# EAGLE board sd2snes1 (EAGLE 4.15), part 1 of 2
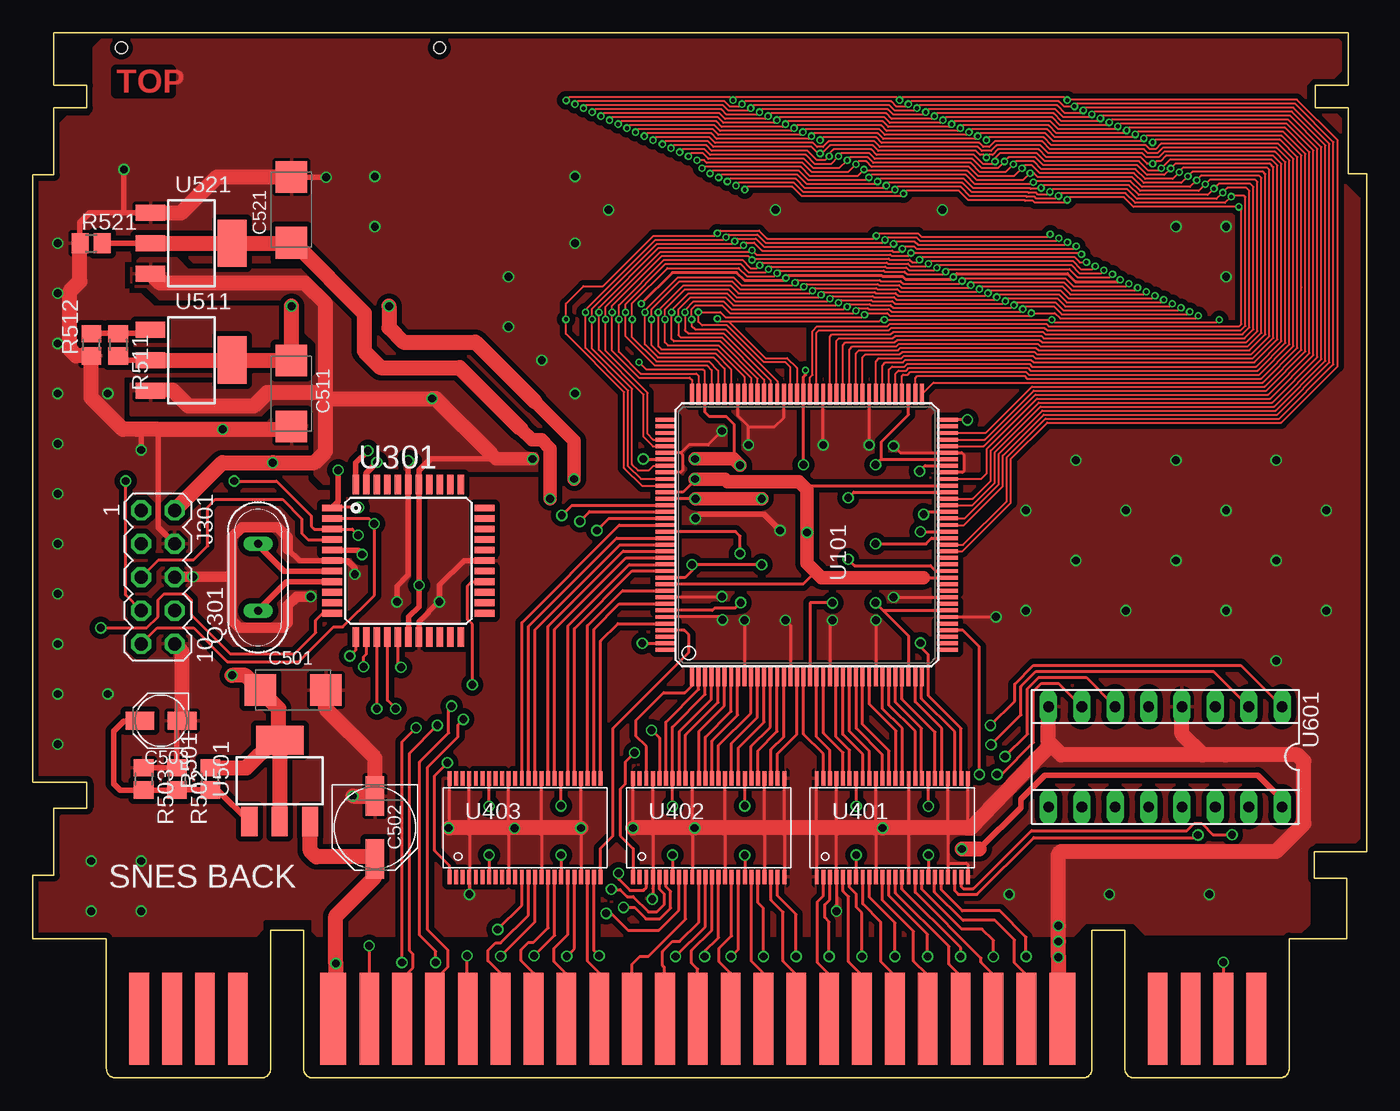
[diagram p4: board, top side]
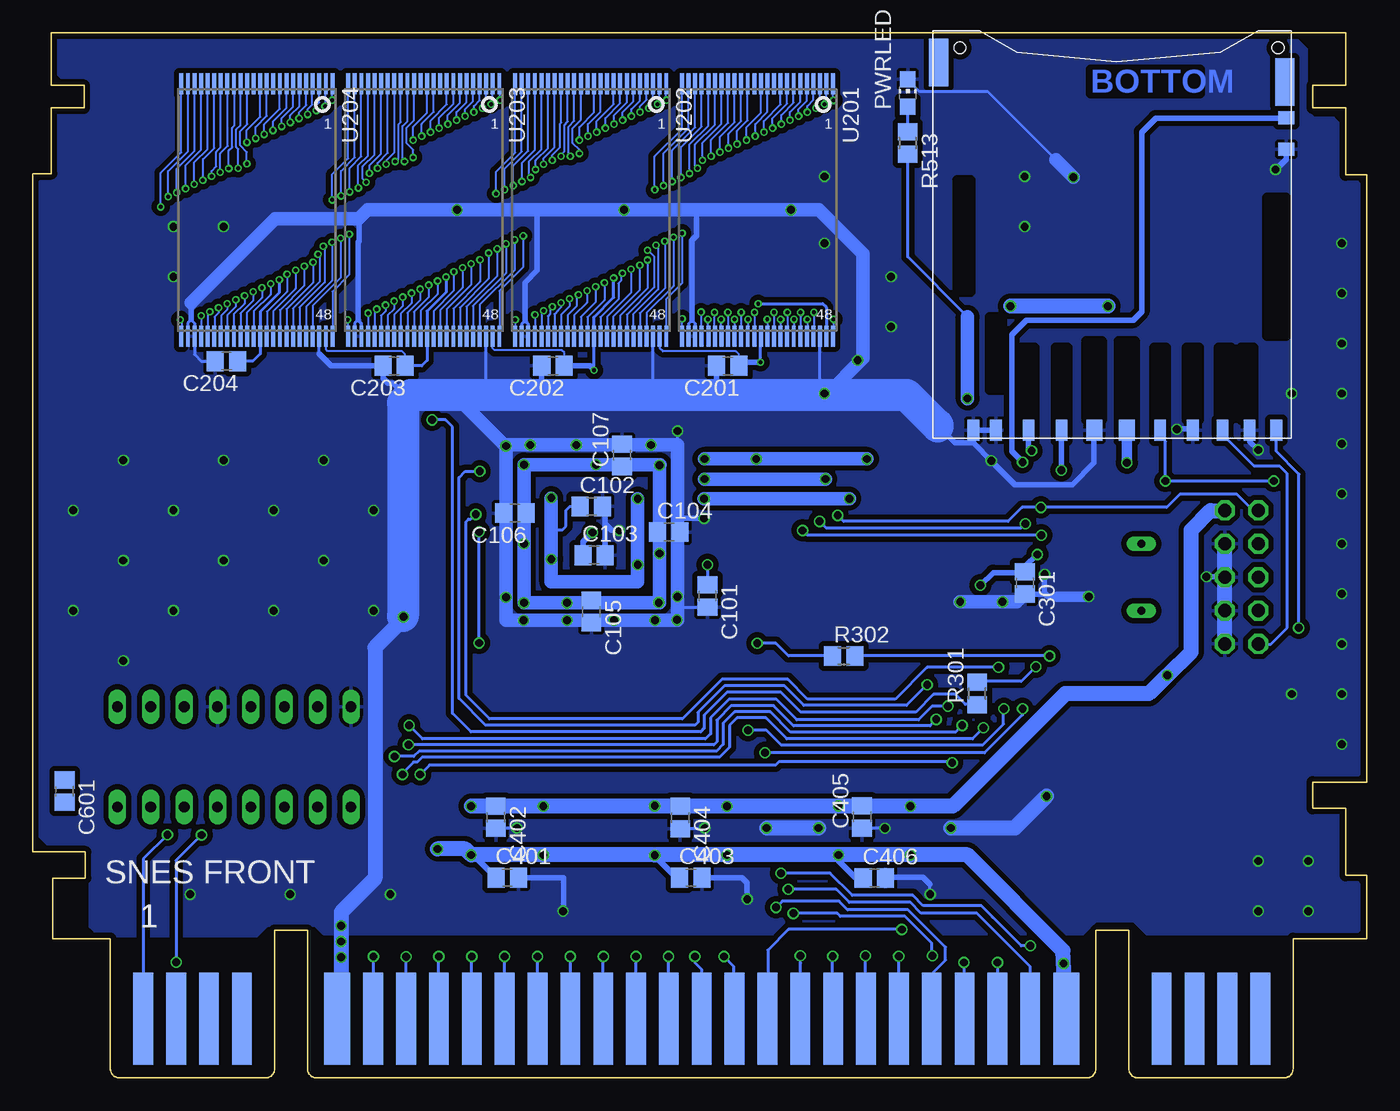
[diagram p5: board, bottom side, seen from below]

Size 101.5 x 79.5 mm. Coordinates in mm from the lower left corner, seen from the top.
Copper layers (1*16): Top 0.035mm / dielectric 1mm / Bottom 0.035mm
Design rules "myBilex DRU": minimum track width 6mil, minimum drill 0.3mm, track to track 6mil, track to pad 6mil, pad to pad 6mil, via to via 6mil, smd to smd 6mil, copper to edge 10mil, drill to drill 8mil, minimum pad ring 10mil, minimum via ring 5mil, stop-mask expansion 4mil, vias tented up to drill 0mil, thermal gap 10mil

## Footprints (pad centres in the part's own frame; a part is rotated, then mirrored left to right if it is on the bottom)
C0805 = smd 1.3 x 1.5: 1 -0.85,0; 2 0.85,0
SMC_C = smd 2.4 x 2.4: + -2.5,0; - 2.5,0
PANASONIC_D = smd 3 x 1.4: + 2.4,0; - -2.4,0
PANASONIC_B = smd 2.2 x 1.4: + 1.6,0; - -1.6,0
SNESCART = smd 1.5 x 7: 1 -42.5,-0.5; 2 -40,-0.5; 3 -37.5,-0.5; 4 -35,-0.5; 6 -25,-0.5; 7 -22.5,-0.5; 8 -20,-0.5; 9 -17.5,-0.5; 10 -15,-0.5; 11 -12.5,-0.5; 12 -10,-0.5; 13 -7.5,-0.5; 14 -5,-0.5; 15 -2.5,-0.5; 16 0,-0.5; 17 2.5,-0.5; 18 5,-0.5; 19 7.5,-0.5; 20 10,-0.5; 21 12.5,-0.5; 22 15,-0.5; 23 17.5,-0.5; 24 20,-0.5; 25 22.5,-0.5; 26 25,-0.5; 28 35,-0.5; 29 37.5,-0.5; 30 40,-0.5; 31 42.5,-0.5 | smd 2 x 7: 5 -27.75,-0.5; 27 27.75,-0.5 | smd 1.5 x 7 bottom: 32 -42.5,-0.5; 33 -40,-0.5; 34 -37.5,-0.5; 35 -35,-0.5; 37 -25,-0.5; 38 -22.5,-0.5; 39 -20,-0.5; 40 -17.5,-0.5; 41 -15,-0.5; 42 -12.5,-0.5; 43 -10,-0.5; 44 -7.5,-0.5; 45 -5,-0.5; 46 -2.5,-0.5; 47 0,-0.5; 48 2.5,-0.5; 49 5,-0.5; 50 7.5,-0.5; 51 10,-0.5; 52 12.5,-0.5; 53 15,-0.5; 54 17.5,-0.5; 55 20,-0.5; 56 22.5,-0.5; 57 25,-0.5; 59 35,-0.5; 60 37.5,-0.5; 61 40,-0.5; 62 42.5,-0.5 | smd 2 x 7 bottom: 36 -27.75,-0.5; 58 27.75,-0.5
MA05-2 = drill 1.016 octagon: 1 -5.08,-1.27; 2 -5.08,1.27; 3 -2.54,-1.27; 4 -2.54,1.27; 5 0,-1.27; 6 0,1.27; 7 2.54,-1.27; 8 2.54,1.27; 9 5.08,-1.27; 10 5.08,1.27
CHIP-LED0805 = smd 1.2 x 1.2: A 0,-1.05; C 0,1.05
QS = drill 0.61 long: 1 -2.54,0; 2 2.54,0
R0805 = smd 1.3 x 1.5: 1 -0.85,0; 2 0.85,0
TQ144 = smd 1.6 x 0.3: P1 -10.7,8.75; P2 -10.7,8.25; P3 -10.7,7.75; P4 -10.7,7.25; P5 -10.7,6.75; P6 -10.7,6.25; P7 -10.7,5.75; P8 -10.7,5.25; P9 -10.7,4.75; P10 -10.7,4.25; P11 -10.7,3.75; P12 -10.7,3.25; P13 -10.7,2.75; P14 -10.7,2.25; P15 -10.7,1.75; P16 -10.7,1.25; P17 -10.7,0.75; P18 -10.7,0.25; P19 -10.7,-0.25; P20 -10.7,-0.75; P21 -10.7,-1.25; P22 -10.7,-1.75; P23 -10.7,-2.25; P24 -10.7,-2.75; P25 -10.7,-3.25; P26 -10.7,-3.75; P27 -10.7,-4.25; P28 -10.7,-4.75; P29 -10.7,-5.25; P30 -10.7,-5.75; P31 -10.7,-6.25; P32 -10.7,-6.75; P33 -10.7,-7.25; P34 -10.7,-7.75; P35 -10.7,-8.25; P36 -10.7,-8.75; P73 10.7,-8.75; P74 10.7,-8.25; P75 10.7,-7.75; P76 10.7,-7.25; P77 10.7,-6.75; P78 10.7,-6.25; P79 10.7,-5.75; P80 10.7,-5.25; P81 10.7,-4.75; P82 10.7,-4.25; P83 10.7,-3.75; P84 10.7,-3.25; P85 10.7,-2.75; P86 10.7,-2.25; P87 10.7,-1.75; P88 10.7,-1.25; P89 10.7,-0.75; P90 10.7,-0.25; P91 10.7,0.25; P92 10.7,0.75; P93 10.7,1.25; P94 10.7,1.75; P95 10.7,2.25; P96 10.7,2.75; P97 10.7,3.25; P98 10.7,3.75; P99 10.7,4.25; P100 10.7,4.75; P101 10.7,5.25; P102 10.7,5.75; P103 10.7,6.25; P104 10.7,6.75; P105 10.7,7.25; P106 10.7,7.75; P107 10.7,8.25; P108 10.7,8.75 | smd 0.3 x 1.6: P37 -8.75,-10.7; P38 -8.25,-10.7; P39 -7.75,-10.7; P40 -7.25,-10.7; P41 -6.75,-10.7; P42 -6.25,-10.7; P43 -5.75,-10.7; P44 -5.25,-10.7; P45 -4.75,-10.7; P46 -4.25,-10.7; P47 -3.75,-10.7; P48 -3.25,-10.7; P49 -2.75,-10.7; P50 -2.25,-10.7; P51 -1.75,-10.7; P52 -1.25,-10.7; P53 -0.75,-10.7; P54 -0.25,-10.7; P55 0.25,-10.7; P56 0.75,-10.7; P57 1.25,-10.7; P58 1.75,-10.7; P59 2.25,-10.7; P60 2.75,-10.7; P61 3.25,-10.7; P62 3.75,-10.7; P63 4.25,-10.7; P64 4.75,-10.7; P65 5.25,-10.7; P66 5.75,-10.7; P67 6.25,-10.7; P68 6.75,-10.7; P69 7.25,-10.7; P70 7.75,-10.7; P71 8.25,-10.7; P72 8.75,-10.7; P109 8.75,10.7; P110 8.25,10.7; P111 7.75,10.7; P112 7.25,10.7; P113 6.75,10.7; P114 6.25,10.7; P115 5.75,10.7; P116 5.25,10.7; P117 4.75,10.7; P118 4.25,10.7; P119 3.75,10.7; P120 3.25,10.7; P121 2.75,10.7; P122 2.25,10.7; P123 1.75,10.7; P124 1.25,10.7; P125 0.75,10.7; P126 0.25,10.7; P127 -0.25,10.7; P128 -0.75,10.7; P129 -1.25,10.7; P130 -1.75,10.7; P131 -2.25,10.7; P132 -2.75,10.7; P133 -3.25,10.7; P134 -3.75,10.7; P135 -4.25,10.7; P136 -4.75,10.7; P137 -5.25,10.7; P138 -5.75,10.7; P139 -6.25,10.7; P140 -6.75,10.7; P141 -7.25,10.7; P142 -7.75,10.7; P143 -8.25,10.7; P144 -8.75,10.7
TSOP48 = smd 0.3 x 1.6: 1 -5.75,-9.6; 2 -5.25,-9.6; 3 -4.75,-9.6; 4 -4.25,-9.6; 5 -3.75,-9.6; 6 -3.25,-9.6; 7 -2.75,-9.6; 8 -2.25,-9.6; 9 -1.75,-9.6; 10 -1.25,-9.6; 11 -0.75,-9.6; 12 -0.25,-9.6; 13 0.25,-9.6; 14 0.75,-9.6; 15 1.25,-9.6; 16 1.75,-9.6; 17 2.25,-9.6; 18 2.75,-9.6; 19 3.25,-9.6; 20 3.75,-9.6; 21 4.25,-9.6; 22 4.75,-9.6; 23 5.25,-9.6; 24 5.75,-9.6; 25 5.75,9.6; 26 5.25,9.6; 27 4.75,9.6; 28 4.25,9.6; 29 3.75,9.6; 30 3.25,9.6; 31 2.75,9.6; 32 2.25,9.6; 33 1.75,9.6; 34 1.25,9.6; 35 0.75,9.6; 36 0.25,9.6; 37 -0.25,9.6; 38 -0.75,9.6; 39 -1.25,9.6; 40 -1.75,9.6; 41 -2.25,9.6; 42 -2.75,9.6; 43 -3.25,9.6; 44 -3.75,9.6; 45 -4.25,9.6; 46 -4.75,9.6; 47 -5.25,9.6; 48 -5.75,9.6
TQFP44 = smd 1.5 x 0.5: 1 -5.8,4; 2 -5.8,3.2; 3 -5.8,2.4; 4 -5.8,1.6; 5 -5.8,0.8; 6 -5.8,0; 7 -5.8,-0.8; 8 -5.8,-1.6; 9 -5.8,-2.4; 10 -5.8,-3.2; 11 -5.8,-4; 23 5.8,-4; 24 5.8,-3.2; 25 5.8,-2.4; 26 5.8,-1.6; 27 5.8,-0.8; 28 5.8,0; 29 5.8,0.8; 30 5.8,1.6; 31 5.8,2.4; 32 5.8,3.2; 33 5.8,4 | smd 0.5 x 1.5: 12 -4,-5.8; 13 -3.2,-5.8; 14 -2.4,-5.8; 15 -1.6,-5.8; 16 -0.8,-5.8; 17 0,-5.8; 18 0.8,-5.8; 19 1.6,-5.8; 20 2.4,-5.8; 21 3.2,-5.8; 22 4,-5.8; 34 4,5.8; 35 3.2,5.8; 36 2.4,5.8; 37 1.6,5.8; 38 0.8,5.8; 39 0,5.8; 40 -0.8,5.8; 41 -1.6,5.8; 42 -2.4,5.8; 43 -3.2,5.8; 44 -4,5.8
TSSOP48 = smd 0.3 x 1.1: 1 -5.75,-3.75; 2 -5.25,-3.75; 3 -4.75,-3.75; 4 -4.25,-3.75; 5 -3.75,-3.75; 6 -3.25,-3.75; 7 -2.75,-3.75; 8 -2.25,-3.75; 9 -1.75,-3.75; 10 -1.25,-3.75; 11 -0.75,-3.75; 12 -0.25,-3.75; 13 0.25,-3.75; 14 0.75,-3.75; 15 1.25,-3.75; 16 1.75,-3.75; 17 2.25,-3.75; 18 2.75,-3.75; 19 3.25,-3.75; 20 3.75,-3.75; 21 4.25,-3.75; 22 4.75,-3.75; 23 5.25,-3.75; 24 5.75,-3.75; 25 5.75,3.75; 26 5.25,3.75; 27 4.75,3.75; 28 4.25,3.75; 29 3.75,3.75; 30 3.25,3.75; 31 2.75,3.75; 32 2.25,3.75; 33 1.75,3.75; 34 1.25,3.75; 35 0.75,3.75; 36 0.25,3.75; 37 -0.25,3.75; 38 -0.75,3.75; 39 -1.25,3.75; 40 -1.75,3.75; 41 -2.25,3.75; 42 -2.75,3.75; 43 -3.25,3.75; 44 -3.75,3.75; 45 -4.25,3.75; 46 -4.75,3.75; 47 -5.25,3.75; 48 -5.75,3.75
SOT223 = smd 1.219 x 2.235: 1 -2.311,-3.099; 2 0,-3.099; 3 2.311,-3.099 | smd 3.6 x 2.2: TAB 0,3.099
SOCKED-16 = drill 0.813 long: 1 -8.89,-3.81; 2 -6.35,-3.81; 3 -3.81,-3.81; 4 -1.27,-3.81; 5 1.27,-3.81; 6 3.81,-3.81; 7 6.35,-3.81; 8 8.89,-3.81; 9 8.89,3.81; 10 6.35,3.81; 11 3.81,3.81; 12 1.27,3.81; 13 -1.27,3.81; 14 -3.81,3.81; 15 -6.35,3.81; 16 -8.89,3.81
JAE-SG5S009V1A = smd 0.9 x 1.6: 1 6.875,14.44; 2 4.375,14.44; 5 -3.125,14.44; 6 -5.625,14.44; 7 -7.875,14.44; 8 -9.925,14.44; 9 9.375,14.44; CARD_DET1 -11.975,14.44; CARD_DET2 11.075,14.44 | smd 1.2 x 1.6: 3 1.875,14.44; 4 -0.6,14.44 | smd 1.45 x 3.6: GND -12.625,-12.06; GND@1 13.725,-13.56 | smd 1.25 x 1: WP_1 -12.725,-9.36; WP_2 -12.725,-6.96 | hole 0.9: -12.1,-14.66; 12.1,-14.66

## Placement (x,y rotation side)
C101  100n  [C0805]  50.16,36.67 270 bottom
C102  100n  [C0805]  59,43.48 0 bottom
C103  100n  [C0805]  58.8,39.77 0 bottom
C104  100n  [C0805]  53.11,41.52 0 bottom
C105  100n  [C0805]  59,35.48 270 bottom
C106  100n  [C0805]  64.82,42.97 180 bottom
C107  100n  [C0805]  56.66,47.36 90 bottom
C201  100n  [C0805]  48.61,54.17 180 bottom
C202  100n  [C0805]  61.92,54.17 180 bottom
C203  100n  [C0805]  74.01,54.17 180 bottom
C204  100n  [C0805]  86.76,54.53 180 bottom
C301  100n  [C0805]  26,37.66 270 bottom
C401  100n  [C0805]  65.4,15.23 0 bottom
C402  100n  [C0805]  66.26,19.83 270 bottom
C403  100n  [C0805]  51.43,15.23 0 bottom
C404  100n  [C0805]  52.24,19.8 270 bottom
C405  100n  [C0805]  38.4,19.86 90 bottom
C406  100n  [C0805]  37.46,15.21 0 bottom
C501  T_100u  [SMC_C]  19.81,29.51 0 top
C502  100u/16V  [PANASONIC_D]  26.03,19.04 270 top
C503  22u/16V  [PANASONIC_B]  9.75,27.17 180 top
C511  T_100u  [SMC_C]  19.68,52.06 270 top
C521  T_100u  [SMC_C]  19.68,66.03 90 top
C601  100n  [C0805]  99.08,21.81 270 bottom
J1  CARTSLOT  [SNESCART]  50.6,5 0 bottom
J301  [MA05-2]  9.52,38.09 270 top
PWRLED  [CHIP-LED0805]  34.92,74.92 0 bottom
Q301  13MHz  [QS]  17.14,38.09 90 top
R301  270  [R0805]  29.64,29.25 90 bottom
R302  270  [R0805]  39.8,32.1 0 bottom
R501  100  [R0805]  13.51,22.75 90 top
R502  180  [R0805]  10.97,22.75 270 top
R503  2k2  [R0805]  8.43,22.75 270 top
R511  100  [R0805]  6.5,55.77 270 top
R512  100  [R0805]  4.47,55.77 90 top
R513  82  [R0805]  34.92,71.11 270 bottom
R521  100  [R0805]  4.44,63.49 0 top
U101  XC3S200TQ144TQ144  [TQ144]  58.9,41.31 90 top
U201  CY62167DV30ZXI  [TSOP48]  46.35,66.03 180 bottom
U202  CY62167DV30ZXI  [TSOP48]  59.05,66.03 180 bottom
U203  CY62167DV30ZXI  [TSOP48]  71.75,66.03 180 bottom
U204  CY62167DV30ZXI  [TSOP48]  84.45,66.03 180 bottom
U301  ATMEGA644-20AU  [TQFP44]  28.58,39.35 0 top
U401  74ALVC164245DGG  [TSSOP48]  65.4,19.04 0 top
U402  74ALVC164245DGG  [TSSOP48]  51.43,19.04 0 top
U403  74ALVC164245DGG  [TSSOP48]  37.46,19.04 0 top
U501  LM1117MPX-ADJ  [SOT223]  18.79,22.6 0 top
U511  LM1117MPX-ADJ  [SOT223]  12.06,54.6 270 top
U521  LM1117MPX-ADJ  [SOT223]  12.06,63.49 270 top
U601  CIC  [SOCKED-16]  86.18,24.43 180 top
U$2  JAE-SG5S009V1A  [JAE-SG5S009V1A]  18.84,63.7 180 bottom

## Tracks (layer width: path | path; a pad name or v marks a point on that pad's centre or on a via)
+1.25V  (via drill 0.6)
  Top 0.229: U101.P121 v50.41,44.06 | U101.P133 49.62,38.06 50.16,38.6 v50.16,39.03 v55.47,39.03 | U101.P61 62.47,44.56 v62.05,44.14 | U101.P49 68.74,38.56 68.32,38.98 62.53,38.98 v62.05,39.46
  Top 0.406: R521.2 U521.2
  Top 1.016: 37.13,49.4 37.99,48.53 38.71,48.53 39.37,47.87 v39.37,44.06 | v50.41,44.06 v55.47,44.06
  Top 1.143: U521.2 9.09,63.49 9.11,63.47 9.14,63.49 U521.TAB 19.68,63.49 19.71,63.52 | 19.71,63.52 C521.+ | 19.71,63.52 19.88,63.52 25.22,58.18 25.22,55.29 26.46,54.04 32.48,54.04 37.13,49.4
  Bottom 0.229: 50.16,37.66 C101.1 v50.16,39.03 | 62.05,44.11 v62.05,44.14 | C102.1 60.63,43.48 60.93,43.17 60.93,41.98 61.21,41.7 62.05,41.7 62.07,41.7
  Bottom 1.016: v39.37,44.06 v50.41,44.06 | v55.47,44.06 v55.47,39.03 55.47,37.74 62.05,37.74 v62.05,39.46 62.05,41.7 62.05,44.11
+2.5V  (via drill 0.6)
  Top 0.229: v50.39,45.56 50.39,45.48 49.47,44.56 U101.P120 | U101.P134 58.62,37.56 59.57,38.51 | U101.P48 67.74,38.06 67.74,38.07 | U101.P62 58.98,45.06 58.8,44.87
  Top 0.406: 58.92,41.52 58.95,41.52 v58.92,41.5 | R511.2 6.82,54.6 9.34,54.6
  Top 1.016: 38.22,51.43 41.19,48.46 v41.19,45.56 | v50.39,45.56 52.68,45.56 52.88,45.36 58.31,45.36 58.8,44.87 58.92,44.75 58.92,41.52 58.92,39.16 59.57,38.51 60.02,38.07 67.74,38.07 67.76,38.07
  Top 1.143: U511.2 9.34,54.6 U511.TAB 19.68,54.6 | 19.68,54.6 v19.68,58.72 | v27.1,58.72 27.1,57.07 28.19,55.97 33.68,55.97 38.22,51.43 | 19.68,54.6 C511.+
  Bottom 0.406: C103.1 59.65,40.77 v58.92,41.5
  Bottom 1.016: v41.19,45.56 v50.39,45.56
  Bottom 1.143: v19.68,58.72 v27.1,58.72
+3V3  (via drill 0.3, 0.6)
  Top 0.152: U101.P106 51.15,53.74 51,53.89 46.68,53.89 v46.12,54.45 | v58.8,53.84 58.82,53.84
  Top 0.229: U101.P3 51.15,30.62 | U101.P3 | U101.P3 51.15,29.18 48.66,26.69 48.66,22.81 U402.42 48.68,20.75 v48.69,20.67 | U403.42 34.71,20.75 v34.72,20.67 | U403.31 v40.21,20.7 v40.2,20.69 | U402.31 v54.18,20.7 v54.17,20.69 | U401.31 v68.14,20.67 | U401.42 v62.66,20.67 | U101.P138 51.72,35.56 51.89,35.73 53.44,35.73 v53.87,36.16 | U101.P19 59.15,36.13 59.15,36.14 v60.85,36.14 | U101.P34 66.65,33.62 v64.13,36.14 64.7,35.56 U101.P43 | U101.P54 68.4,41.06 67.97,40.63 v64.13,40.63 | 64.59,47.06 64.54,47.06 v64.13,46.65 | 64.59,47.06 U101.P66 | v58.64,46.65 58.65,46.63 U101.P91 58.65,52.14 58.64,52.14 58.64,53.33 58.8,53.48 v58.8,53.84 | U101.P106 51.15,50.64 51.48,50.31 52.78,50.31 53.39,49.7 53.39,47.08 53.36,47.06 | U101.P115 46.45,47.06 v46.45,47.08 | U101.P126 53.48,41.56 53.82,41.22 v53.82,39.9 | U101.P75 66.65,50.46 64.59,48.4 64.59,47.06 | 64.59,47.06 | 57.27,60.83 57.09,60.65 54.17,60.65 53.56,61.26 48.66,61.26 v46.3,58.9 | v57.3,60.85 57.27,60.83 | 57.27,60.83 57.5,61.05 64.59,61.05 64.66,60.98 66.19,60.98 66.39,60.77 69.9,60.77 v70.05,60.93 70.3,61.18 78.74,61.18 79.35,60.57 82.6,60.57 v82.75,60.72
  Top 0.406: 35.66,47.08 35.66,47.11 30.27,47.11 29.38,46.22 U301.38 v29.38,37.49 v29.38,37.48 29.38,35.86 28.6,35.07 28.6,33.53 | 28.6,33.53 28.6,33.24 | 28.6,33.53 U301.17 | U301.5 24.74,40.15 v25.07,39.82 | 30.4,51.68 30.4,51.73 30.37,51.71 v30.37,51.68
  Top 1.016: 34.9,47.44 35.25,47.08 35.66,47.08 v38.02,47.08 | v50.39,47.08 53.34,47.08 53.36,47.06 | 53.36,47.06 53.69,46.73 | 53.36,47.06 v53.82,46.6
  Top 1.143: U501.TAB U501.2 | 13.5,23.59 13.41,23.59 | R501.2 13.5,23.59 | 13.5,23.59 16.25,23.59 18.36,25.7 U501.TAB | J301.2 14.42,46.8 v18.26,46.8 21.43,46.8 22.27,47.64 22.27,51.68 | 22.27,51.68 22.27,51.96 22.09,52.14 17.83,52.14 16.78,51.1 11.86,51.1 10.64,52.32 8.99,52.32 U511.3 | U521.3 9.67,60.47 20.7,60.47 22.27,58.9 22.27,51.68 | 22.27,51.68 v30.37,51.68 30.4,51.68 30.65,51.68 34.9,47.44 | v15.16,30.62 16.19,30.62 C501.+ 18.72,28.1 18.72,25.7 U501.TAB | U501.TAB
  Bottom 0.152: 46.12,56.48 46.1,56.46 U201.37 | U202.47 53.77,56.4 53.77,55.47 53.56,55.26 48,55.26 47.77,55.03 47.77,54.42 47.76,54.44 C201.1 | U203.47 66.5,55.5 66.37,55.36 61.26,55.36 61.06,55.16 61.06,54.17 | U204.47 79.2,55.42 79.07,55.29 73.4,55.29 73.17,55.06 73.17,54.2 73.16,54.18 C203.1
  Bottom 0.229: 40.2,20.67 v40.2,20.69 | 36.67,20.67 36.67,20.72 36.69,20.71 C405.2 | 54.17,20.67 v54.17,20.69 54.2,20.69 54.16,20.65 C404.1 | C402.1 66.28,20.67 v68.14,20.67 | 53.82,36.19 53.87,36.19 v53.87,36.16 | 64.13,36.24 64.08,36.24 v64.13,36.14 | v64.13,40.63 64.11,40.63 63.97,40.77 C106.1 | v64.13,46.65 64.03,46.63 | 58.62,46.65 58.62,46.63 v58.64,46.65 | 46.4,47.08 46.4,47.06 v46.45,47.08 | 53.82,43.1 53.84,43.1 53.84,42.87 | C104.1 53.84,41.63 53.84,42.87 | 53.82,42.87 53.84,42.87 | 46.12,56.48 v46.12,54.45 46.1,54.42 | v58.8,53.84 58.8,55.01 U202.37 58.8,57.88 57.3,59.38 v57.3,60.85 | v46.3,58.9 41.4,58.9 41.12,58.62 41.12,56.43 U201.47 | v70.05,60.93 70.05,59.78 71.5,58.33 U203.37 71.5,54.58 71.9,54.17 C203.1 | U204.37 84.2,58.29 82.75,59.73 v82.75,60.72 | 30.37,57.88 30.35,57.88 34.92,62.45 R513.2 | 47.79,54.42 47.82,54.42 | 47.79,54.42 C201.1 | 47.77,54.42 47.79,54.42 | 58.77,53.84 58.75,53.82 | U204.37 84.22,56.41 84.2,56.38 | C204.1 84.76,54.53 84.2,55.09 84.2,56.33 84.22,56.36 84.2,56.38 U204.37
  Bottom 0.406: v25.07,39.82 25.07,39.85 26.03,38.88 26.03,38.49 | 26.03,38.45 26.03,38.4 | 26.03,38.45 26.03,38.49 | 26.03,38.49 C301.1 | v29.38,37.48 28.42,38.45 26.03,38.45 | 46.1,54.42 47.77,54.42 | v58.8,53.84 58.77,53.84 59.1,54.17 61.06,54.17 C202.1
  Bottom 0.813: v18.26,46.8 18.23,46.8 18.23,49.22 U$2.4
  Bottom 1.016: v38.02,47.08 46.4,47.08 v50.39,47.08 | v53.82,46.6 53.82,43.1 53.82,42.87 v53.82,39.9 53.82,36.19 53.82,36.14 57.63,36.14 | 57.63,36.14 v60.85,36.14 v64.13,36.14 64.13,36.24 v64.13,40.63 v64.13,46.65 58.62,46.65 57.88,46.65 | 57.88,46.65 53.79,46.65 | C107.1 56.66,46.65 57.88,46.65 | C105.1 59,36.14 57.63,36.14 | v30.37,51.68 30.37,57.88 30.37,57.9
  Bottom 1.143: v68.14,20.67 v62.66,20.67 54.17,20.67 v48.69,20.67 40.2,20.67 36.67,20.67 v34.72,20.67 31.49,20.67 22.93,29.23 16.58,29.23 v15.16,30.62 13.36,32.4 13.36,41.67 11.88,43.15 10.77,43.15 | 10.77,43.15 10.69,43.15 | 10.77,43.15 J301.2
  pour Top (isolate 0.406): 27.73,46.19 27.73,47.57 28.04,47.87 29.05,47.87 29.69,47.24 29.69,46.73 30.17,46.25 38.91,46.25 39.06,46.4 39.06,47.57 38.53,48.1 37.71,48.1 32.33,53.48 26.31,53.48 24.43,55.36 24.43,57.75 20.75,61.43 11.83,61.43 10.97,62.3 8.12,62.3 7.49,61.66 7.49,60.52 7.77,60.24 8.63,60.24 9.6,59.28 19.93,59.28 20.62,58.59 20.62,56.84 21.59,55.87 21.59,53.56 21.18,53.15 18.69,53.15 17.95,53.89 17.14,53.89 16.02,52.77 7.44,52.77 7.44,50.46 7.72,50.18 17.14,50.18 18.11,51.15 20.9,51.15 21.46,50.59 21.46,45.89 22.09,45.26 26.79,45.26
+5V  (via drill 0.6)
  Top 0.229: U403.18 40.21,16.93 v40.2,16.96 | U403.7 34.71,16.9 v34.72,16.96 | U402.18 v54.18,16.93 v54.17,16.93 | U402.7 48.68,16.9 v48.69,16.96 | U401.7 62.65,16.9 v62.66,16.96 | U401.18 68.15,16.9 v68.14,16.96
  Top 0.406: 72.03,17.42 75.18,20.57 75.18,21.2 77.01,23.03 93.21,23.03 95.07,21.18 U601.16
  Top 1.143: J1.27 23.06,4.54 v23.06,8.7 23.06,12.31 26.01,15.26 26.01,15.97 | 26.01,16.67 26.01,16.81 21.56,16.81 21.1,17.26 U501.3 | 26.01,16.67 C502.+ | 26.01,15.97 26.01,16.67 | 26.01,15.97 26.03,15.97 26,15.94 | v70.71,17.42 72.03,17.42 | U501.3
  Top 1.2: J1.27 23.11,4.5
  Bottom 0.229: 54.17,16.99 54.17,16.96 v54.17,16.93 | v68.14,16.96 68.14,16.99 | 40.23,16.96 40.2,16.93
  Bottom 0.406: 40.2,16.93 40.2,16.53 38.91,15.23 38.3,15.23 38.31,15.22 C406.1 | v68.14,16.96 68.14,16.83 67.85,16.83 C401.1 | v54.17,16.93 54.17,16.88 52.52,15.23 C403.1 | J1.27 23.06,4.54 v23.06,8.7
  Bottom 1.143: J1.27 23.1,9.69 30.37,16.96 v34.72,16.96 v40.2,16.96 40.23,16.96 v48.69,16.96 54.17,16.96 v62.66,16.96 v68.14,16.96 68.6,17.42 v70.71,17.42
BANK0_CE  (via drill 0.3)
  Top 0.152: U101.P77 65.65,53.58 65.88,53.82 66.47,53.82 66.67,54.02 75.71,54.02 75.92,53.82 93.21,53.82 95.32,55.92 95.32,69.66 94.53,70.45 86.1,70.45 85.7,70.05 84.73,70.05 84.43,70.35 77.26,70.35 76.68,70.93 73.33,70.93 72.92,70.53 72.21,70.53 71.9,70.83 64.46,70.83 64.05,71.24 60.55,71.24 60.14,70.83 59.69,70.83 59.38,71.14 51.91,71.14 51.51,71.54 47.39,71.54 v47.19,71.34
  Bottom 0.152: U201.12 46.1,73.42 47.19,72.33 v47.19,71.34
BANK1_CE  (via drill 0.3)
  Top 0.152: U101.P76 66.15,53.42 66.24,53.51 66.59,53.51 66.8,53.71 75.59,53.71 75.79,53.51 93.34,53.51 95.63,55.8 95.63,69.79 94.66,70.76 85.97,70.76 85.57,70.35 84.86,70.35 84.55,70.66 77.39,70.66 76.81,71.24 73.2,71.24 72.79,70.83 72.33,70.83 72.03,71.14 64.59,71.14 64.18,71.54 60.12,71.54 v59.91,71.34
  Bottom 0.152: U202.12 58.8,73.45 59.91,72.33 v59.91,71.34
BANK2_CE  (via drill 0.3)
  Top 0.152: U101.P74 67.15,53.22 67.33,53.41 75.46,53.41 75.66,53.21 93.47,53.21 95.93,55.67 95.93,69.92 94.79,71.06 85.85,71.06 85.44,70.66 84.98,70.66 84.68,70.96 77.52,70.96 76.93,71.54 72.77,71.54 v72.56,71.34
  Bottom 0.152: U203.12 71.5,73.42 72.56,72.36 v72.56,71.34
BANK3_CE  (via drill 0.3)
  Top 0.152: U101.P73 68.53,52.9 93.59,52.9 96.24,55.54 96.24,70.05 94.92,71.37 85.42,71.37 v85.21,71.16
  Bottom 0.152: U204.12 84.2,73.12 85.21,72.1 v85.21,71.16
CCLK  (via drill 0.6)
  Top 0.229: U101.P72 69.64,50.06 v71.12,50.06
  Bottom 0.229: v71.12,50.06 70.1,50.06 69.57,49.52 69.57,27.73 68.17,26.33 50.67,26.33 50.41,26.59 50.41,27.6 48.66,29.35 44.57,29.35 43.05,27.83 34.31,27.83 32.96,29.18 31.31,29.18 30.55,28.42 29.63,28.42 | 29.63,28.42 29.59,28.42 | R301.1 29.63,28.42
CCLK_AVR  (via drill 0.6)
  Top 0.229: U301.13 25.4,33.53 25.4,32.25 25.17,32.02 v25.17,31.29
  Bottom 0.229: 29.7,30.17 29.76,30.17 | 29.7,30.17 R301.2 | v25.17,31.29 26.28,30.17 29.7,30.17
DIN/FPGA_SS  (via drill 0.6)
  Top 0.229: U301.26 34.37,37.74 33.37,37.74 33.07,37.43 33.07,34.89 33.45,34.51 v33.45,29.91 | U101.P65 69.59,46.58 67.89,46.58 67.46,46.14 v67.48,46.14
  Bottom 0.229: v33.45,29.91 35.02,28.34 42.82,28.34 44.32,29.84 48.87,29.84 50.9,27.81 50.9,27.04 51.1,26.84 67.05,26.84 69.08,28.87 69.08,45.66 68.6,46.14 v67.48,46.14 67.46,46.14
GND  (via drill 0.6)
  Top 0.229: 38.71,19.02 38.71,18.99 | U403.34 38.71,19 38.71,18.99 | 36.22,19.04 36.22,19.02 36.22,18.99 36.6,18.99 | 36.22,19.04 36.22,19.07 36.21,19.07 U403.39 | 33.21,19.07 33.21,19.03 33.22,19.02 | 33.21,19.07 U403.45 | U403.48 31.71,19.03 31.69,19.02 | U403.4 | 36.22,19.04 36.27,18.99 36.6,18.99 | U403.10 36.21,19.04 36.22,19.04 | U403.15 38.71,18.99 | 38.71,18.99 38.43,18.99 38.35,19.07 36.67,19.07 36.6,18.99 | 36.6,18.99 v36.65,18.99 | v41.7,19.02 41.7,19.09 | U403.21 41.71,19.09 41.7,19.09 | U403.28 41.71,19.1 41.7,19.09 | 33.21,19.07 33.22,19.07 | 50.34,19.02 50.34,19.04 v50.36,19.02 | U402.39 50.18,19.02 50.19,19.02 | U402.48 45.68,19.03 45.69,19.02 | U402.45 47.18,19 47.19,18.99 47.19,19.02 47.18,19.01 U402.4 | U402.34 52.68,19.1 52.6,19.02 52.32,19.02 52.24,18.94 50.41,18.94 50.36,18.99 | U402.28 55.68,19.03 55.67,19.02 55.67,18.99 55.68,18.98 U402.21 | U402.25 57.18,19.03 57.17,19.02 57.18,19.01 U402.24 | U401.48 59.65,19.03 59.66,19.02 | 61.16,19.02 61.16,19.07 61.15,19.08 U401.45 | U401.39 64.15,19.1 64.16,19.09 64.16,19.02 U401.10 | 66.65,19.07 66.65,19.04 66.67,19.02 | 66.65,19.07 U401.34 | U401.28 69.65,19.03 69.64,19.02 69.64,16.35 | U401.25 71.15,19.03 71.14,19.02 | v50.36,19.02 50.36,18.99 | U402.10 50.18,18.81 50.36,18.99 | U402.15 52.68,18.66 52.24,19.09 50.39,19.09 50.31,19.02 v50.36,19.02 | 47.19,15.46 47.18,15.45 U402.4 | U401.1 59.63,15.31 59.63,19.02 | U401.4 61.13,15.31 61.13,19.02 | 66.65,19.07 U401.15 | U401.21 69.64,16.35 | U401.24 71.14,16.22 71.01,16.35 69.64,16.35 | 64.64,19.02 64.64,19.04 v64.66,19.02 | 61.16,15.31 U401.4 | 61.16,15.31 61.15,15.31 U401.4 | 61.16,15.31 v61.16,12.69
  Top 0.229: U403.4 | 33.24,19.02 33.24,18.99 33.22,18.97 | U402.4 47.18,14.4 47.19,14.39 47.19,13.68 47.11,13.61 v47.14,13.61 | U403.4 | U101.P114 48.22,47.54 49.3,47.54 | 49.3,47.54 49.32,47.54 49.93,48.15 51.38,48.15 v52.45,49.22 | U101.P117 49.29,46.06 49.45,46.22 49.45,47.39 49.3,47.54 | U101.P139 48.19,35.06 48.18,35.07 52.24,35.07 v52.47,34.84 | U101.P136 52.44,36.56 v52.45,36.62 | U101.P16 57.65,34.44 v57.27,34.82 | U101.P22 60.65,34.56 v60.85,34.82 | U101.P29 64.15,34.81 v64.16,34.82 | U101.P9 v54.15,34.81 v54.15,34.82 | U101.P42 v73.29,35.06 v73.3,35.07 | U101.P45 v65.51,36.56 v65.5,36.57 | U101.P101 53.65,50.38 54.45,49.57 54.45,49.52 | v54.45,48.15 54.45,49.52 | U101.P94 57.15,50.23 56.43,49.52 54.45,49.52 | U101.P88 v60.14,48.15 | U101.P81 v63.65,48.15 | 69.57,47.56 66.01,47.56 66.01,47.57 | 69.57,47.56 U101.P67 70.68,47.57 70.84,47.41 70.84,46.17 70.73,46.06 U101.P64 | 69.57,47.56 69.57,47.57 66.01,47.57 | v65.5,48.07 66.01,47.57 | 33.22,19.02 33.22,19.04 | 33.22,19.02 v33.22,13.96 33.22,15.28 U403.4
  Top 0.406: 10.94,23.58 10.94,23.54 | 10.94,23.58 R502.1 10.95,23.61 8.41,23.61 | C503.- 10.94,26.76 10.94,23.58 | 8.41,23.61 8.4,23.61 | R503.1 8.41,23.61 | 3.53,63.54 3.58,63.49 R521.1 3.55,63.49 3.53,63.52 3.58,63.57 3.58,65.07 4.31,65.8 6.93,65.8 | 6.93,65.8 U521.1 | 28.57,45.13 28.58,45.14 U301.39 | 28.57,45.13 v28.57,46.96 | v56.87,41.65 55.65,42.87 50.72,42.87 v50.41,42.56 | J301.4 9.52,41.9 9.52,49.34 | 6.93,65.8 v6.93,69.11 | U301.6 22.77,39.34 22.35,39.34 | 22.35,39.34 20.29,39.34 19.4,40.23 | 28.57,45.13 28.57,38.27 27.71,37.41 v27.71,36.21 | U301.28 32.8,39.35 30.96,37.51 30.96,36.19 v30.93,36.21 | U301.18 29.38,34.71 30.88,36.21 v30.93,36.21 | v27.71,36.21 27.71,36.19 | v30.93,36.21 30.96,36.21 | C521.- 19.67,68.53 19.66,68.52 v22.32,68.52 | 7.92,49.34 7.92,49.32 8.25,48.99 v8.25,47.77 | 22.35,39.34 23.95,39.34 24.51,38.78 v24.51,38.32 | v27.71,36.21 27.73,36.24
  Top 0.813: 19.4,40.23 19.4,41.14 18.64,41.9 15.92,41.9 15.13,41.12 15.13,38.12 | 15.13,38.12 15.13,34.82 15.72,34.23 19.02,34.23 19.4,34.61 19.4,35.96 20.06,36.62 v21.15,36.62 | 10.77,38.12 v12.19,38.12 15.13,38.12
  Top 1.143: 31.72,19.02 33.22,19.02 33.24,19.02 36.22,19.02 38.71,19.02 v41.7,19.02 | 45.72,19.02 47.19,19.02 50.19,19.02 50.31,19.02 50.34,19.02 v50.36,19.02 52.6,19.02 55.67,19.02 57.17,19.02 59.63,19.02 59.66,19.02 61.13,19.02 61.16,19.02 64.16,19.02 64.64,19.02 v64.66,19.02 66.67,19.02 69.64,19.02 71.14,19.02 71.37,19.02 77.47,25.37 | 78.05,4.45 78.05,4.21 | 78.05,4.45 J1.36 | 78.05,4.45 v78.05,9.19 v78.05,10.38 v78.05,11.57 78.05,17.04 78.25,17.24 94.61,17.24 96.72,19.35 96.72,24.1 96.24,24.58 90.78,24.58 | 90.78,24.58 89.02,24.58 87.45,26.15 U601.4 | U601.8 77.29,25.54 77.47,25.37 | 77.47,25.37 78.25,24.58 90.78,24.58 | 77.47,25.37 77.49,25.39 | J301.10 10.79,32.99 11.35,32.43 C503.- | v24.35,21.43 26.02,21.43 C502.- 26.03,24.35 22.3,28.08 22.3,29.5 C501.- | 31.72,19.02 31.69,19.02 | 31.72,19.02 v31.64,19.02 | 45.72,19.02 45.69,19.02 | 45.72,19.02 v45.66,19.02 | 19.71,49.34 19.68,49.37 C511.- | 19.71,49.34 v14.45,49.34 9.52,49.34 7.92,49.34 6.85,49.34 4.44,51.76 4.44,54.9 R512.1 4.45,54.93 3.3,54.93 2.81,55.42 2.81,59.83 3.58,60.6 3.58,63.49 | 19.71,49.34 19.73,49.32 | U521.1 11.27,65.8 14.02,68.55 19.55,68.55 19.57,68.53 C521.-
  Bottom 0.152: 54.33,51.94 54.3,51.96
  Bottom 0.229: C405.1 36.66,19.01 v36.65,18.99 | C404.2 50.43,18.95 v50.36,19.02 | C402.2 64.7,18.98 v64.66,19.02 | 33.7,15.21 C406.2 | v33.22,13.96 33.22,14.72 | 52.42,48.15 52.45,48.15 v52.45,49.22 | 55.62,48.15 55.62,48.13 55.65,48.1 56.66,48.1 | 52.45,35.96 52.47,35.96 | 52.47,35.96 52.46,35.97 | 52.48,35.97 52.45,35.93 52.47,35.93 52.47,35.96 | 52.45,34.87 52.47,34.87 v52.47,34.84 | v60.85,34.82 60.85,34.79 60.88,34.82 | 73.33,35.15 73.3,35.15 v73.3,35.07 | 52.45,40.48 52.37,40.48 52.37,41.41 C104.2 | 60.17,48.15 v60.14,48.15 | v65.5,48.07 65.48,48.07 | 65.63,42.97 C106.2 65.67,46.06 65.63,46.09 65.63,46.07 65.5,46.07 65.38,46.07 | 52.45,35.83 52.47,35.83 52.46,35.82 C101.2 | C102.2 58.11,43.48 58.09,43.5 57.95,43.36 | J301.10 J301.8 | J301.4 10.77,40.63 | J301.6 10.77,38.12 10.77,37.99 | 51.13,51.94 51.13,51.86 51.1,51.88 | 51.66,51.94 51.66,52.19 51.6,52.25 | U$2.6 13.24,49.28 13.2,49.37 13.25,49.37 | 23.64,69.84 28.82,75.02 34.03,75.02 34.92,75.91 PWRLED.C 34.92,76.04 | 41.6,56.51 U201.46 41.6,51.94 41.6,51.83 | 49.47,54.44 C201.2 | 54.3,51.96 U202.46 | 89.45,57.7 89.45,57.68 | U204.27 89.2,57.42 89.45,57.68 | U204.26 89.7,57.43 89.45,57.68 | U203.26 77,57.43 76.75,57.68 76.5,57.42 U203.27 | 67,51.94 67,52.09 U203.46 | U202.26 64.3,57.35 64.05,57.6 | U202.27 63.8,57.37 64.05,57.63 | U201.26 51.6,57.38 51.35,57.63 | U201.27 51.1,57.4 51.35,57.65 | 79.7,55.08 U204.46 | C203.2 74.77,54.17 | 89.2,56.36 | U204.27 89.2,56.36 | C204.2 88.69,54.53 89.2,55.03 89.2,56.36 | U204.27 89.2,56.41 89.23,56.38 89.2,56.36
  Bottom 0.406: 33.22,14.72 33.7,15.21 33.78,15.28 36.65,15.28 36.7,15.23 36.67,15.21 C406.2 | C401.2 61.13,15.23 61.13,12.67 v61.16,12.69 | C403.2 47.52,15.23 47.14,14.85 v47.14,13.61 | 32.63,49.67 32.66,49.67 | J1.36 78.1,4.49 78.13,4.46 | C102.2 57.96,43.48 57.96,42.16 | C103.2 57.96,42.16 | 58.09,43.5 57.96,43.38 57.96,42.16 | 57.96,42.16 57.45,41.65 v56.87,41.65 | 52.45,42.56 v50.41,42.56 | U$2.WP_2 6.12,69.89 v6.93,69.11 | 28.52,46.88 28.6,46.96 v28.57,46.96 28.57,46.93 28.52,46.88 | 28.52,46.88 26.77,45.13 22.4,45.13 20.75,46.78 20.75,49.27 U$2.3 | J1.36 78.1,4.5 78.1,4.67 | v78.05,9.19 78.08,9.21 78.08,4.53 J1.36 | 28.52,46.88 29.94,48.3 | U$2.8 8.89,49.25 8.89,48.4 v8.25,47.77 | v14.45,49.34 14.42,49.37 13.25,49.37 | v24.51,38.32 24.51,36.9 24.25,36.64 | 24.25,36.64 21.81,36.64 | 24.25,36.64 24.28,36.64 24.44,36.81 C301.2 | 29.94,48.3 29.94,49.24 U$2.CARD_DET2 29.9,49.27 28.23,49.27 U$2.9 | 32.63,49.57 32.61,49.57 31.34,48.3 29.94,48.3 | 10.77,38.12 v12.19,38.12 | 89.45,58.97 89.45,57.7 | 76.75,57.68 76.75,63.57 76.68,63.64 76.68,65.35 76.7,65.37 | 62.77,52.33 C202.2 | 64.05,57.6 64.05,57.63 64.05,60.5 63.11,61.44 63.11,66.03 | 51.35,57.63 51.35,57.65 51.35,63.72 51,64.08 51,66.03 | 49.47,51.94 49.47,54.44 | 72.94,51.73 74.07,52.86 74.48,52.86 74.85,53.23 74.85,54.12 74.82,54.15 C203.2 78.79,54.17 79.7,55.08
  Bottom 0.813: v21.15,36.62 23.54,36.62
  Bottom 1.016: 73.33,51.35 70.1,52.62 66.01,48.53 | 66.01,48.53 65.86,48.38 | 66.01,48.53 65.63,48.15 v63.65,48.15 60.17,48.15 55.62,48.15 v54.45,48.15 52.45,48.15 52.45,42.56 52.45,40.48 v52.45,36.62 52.45,35.96 52.45,35.93 52.45,35.83 52.45,34.87 52.45,34.82 v54.15,34.82 v57.27,34.82 57.37,34.82 | 57.37,34.82 60.88,34.82 v64.16,34.82 65.5,34.82 v65.5,36.57 65.5,46.07 v65.5,48.07 | 56.66,48.1 C107.2 | C105.2 59,34.82 57.37,34.82 | 30.96,36.21 v30.93,36.21 27.96,36.21 | v22.32,68.52 23.64,69.84 | 27.96,36.21 v27.71,36.21 | C301.2 26.6,36.21 27.96,36.21 | 42.92,51.94 42.92,52.06 42.91,52.07 | 42.2,51.95 41.1,51.95 38.32,54.73 38.32,62.68 41.68,66.03 v43.81,66.03 51,66.03 v56.51,66.03 63.11,66.03 v69.21,66.03 76.04,66.03 76.7,65.37 83.05,65.37 89.45,58.97 | 62.78,51.94 62.78,52.32 62.77,52.33
  Bottom 1.143: J301.10 J301.8 J301.6 J301.4 | v24.35,21.43 26.77,19.02 v31.64,19.02 | v45.66,19.02 v41.7,19.02 | J1.36 78.02,4.58 78.02,12.62 75.46,15.18 75.46,32.76 73.33,34.89 73.33,35.1 v73.3,35.07 | 42.21,51.94 42.2,51.95
  Bottom 2.438: 73.33,35.15 73.33,51.35 72.94,51.73 72.74,51.94 67,51.94 62.78,51.94 54.33,51.94 51.66,51.94 51.13,51.94 49.47,51.94 42.92,51.94 42.21,51.94 41.6,51.94 35,51.94 32.63,49.57 32.63,49.67
  other vias: 4.44,16.5 8.25,16.5 8.25,12.69 4.44,12.69 86.99,64.76 90.8,64.76 90.8,60.95 41.27,63.49 41.27,68.57 74.29,13.96 81.91,13.96 89.53,13.96 36.19,60.95 36.19,57.14 38.73,54.6 41.27,52.06 79.37,46.98 86.99,46.98 94.61,46.98 75.56,43.17 83.18,43.17 90.8,43.17 98.42,43.17 94.61,39.36 86.99,39.36 79.37,39.36 75.56,35.55 83.18,35.55 90.8,35.55 98.42,35.55 94.61,31.74 1.9,63.49 1.9,59.68 1.9,55.87 1.9,52.06 5.71,52.06 1.9,48.25 1.9,44.44 1.9,40.63 1.9,36.82 1.9,33.01 1.9,29.2 5.71,29.2 1.9,25.39 26.03,68.57 26.03,64.76
  pour Top (isolate 0.406, rank 6): 0.55,10.86 17.01,10.86 17.45,11.3 17.45,11.93 17.67,12.16 21.13,12.16 21.31,11.98 21.31,11.14 21.59,10.86 79.22,10.86 80.18,11.83 83.76,11.83 84.63,10.97 96.39,10.97 97.12,11.7 97.12,17.44 97.63,17.95 100.66,17.95 100.99,18.28 100.99,66.85 99.79,68.04 99.79,72.69 99.11,73.37 97.43,73.37 96.87,73.93 96.87,75.53 97.46,76.12 99.03,76.12 99.54,76.62 99.54,78.78 99.26,79.06 5.33,79.06 4.64,78.38 4.64,73.5 4.24,73.09 2.59,73.09 2.08,72.59 2.08,68.65 1.7,68.27 0.55,68.27 0.27,67.99 0.27,23.13 0.5,22.9 4.29,22.9 4.74,22.45 4.74,20.54 4.36,20.16 2.41,20.16 2.08,19.83 2.08,15.28 1.75,14.95 0.5,14.95 0.33,14.78 0.33,11.09
  pour Bottom (isolate 0.406, rank 6): 4.59,78.28 4.59,73.6 4.03,73.04 2.54,73.04 2.05,72.56 2.05,68.5 1.75,68.19 0.71,68.19 0.4,67.89 0.4,23.26 0.63,23.03 4.19,23.03 4.59,22.62 4.59,20.49 4.11,20.01 2.15,20.01 1.82,19.68 1.82,15.49 1.34,15 0.81,15 0.48,14.67 0.48,11.32 0.86,10.94 16.73,10.94 17.7,11.9 20.62,11.9 21.59,10.94 79.37,10.94 80.01,11.57 83.66,11.57 84.45,10.79 96.44,10.79 97.15,11.5 97.15,17.06 97.79,17.7 100.33,17.7 101.11,18.48 101.11,68.04 100.55,68.6 100.15,68.6 99.84,68.9 99.84,73.35 99.51,73.68 97.3,73.68 97.07,73.91 97.07,75.46 97.61,75.99 99.23,75.99 99.69,76.45 99.69,78.99 99.44,79.24 5.56,79.24
INIT_B  (via drill 0.6)
  Top 0.229: 27.81,33.52 U301.16 27.78,31.46 v28.01,31.23 | U101.P58 67.99,43.07 v67.79,42.87
  Bottom 0.229: v67.79,42.87 68.19,42.51 68.35,42.51 68.55,42.31 68.55,29.13 66.75,27.32 52.07,27.32 49.07,30.32 44.04,30.32 42.54,28.82 35.86,28.82 33.45,31.23 v28.01,31.23
IRQ_DIR  (via drill 0.6)
  Top 0.229: U403.1 31.71,16.16 30.58,17.29 30.58,23 v31.54,23.97 | v72.03,23.08 72.03,32.81 70.79,34.05 69.57,34.05 69.56,34.06 | 69.56,34.06 69.54,34.08 | 69.56,34.06 U101.P40
  Bottom 0.229: v31.54,23.97 31.62,24.05 44.72,24.05 44.98,23.79 71.32,23.79 v72.03,23.08
MISO  (via drill 0.6)
  Top 0.229: U301.2 25.59,42.55 v25.98,42.16 26.01,42.13 26.01,36.72 23.59,34.31 22.88,34.31 20.24,31.67 14.8,31.67 12.24,34.23 9.47,34.23 J301.9 | U101.P123 | U101.P123 | v41.63,42.33 42.36,43.07 U101.P123
  Bottom 0.229: v25.98,42.16 26.31,41.83 41.12,41.83 v41.63,42.33 | 8.28,32.99 8.3,32.99 | 8.28,32.99 J301.9 | 8.28,32.99 7.31,32.99 6.04,34.26 6.04,45.97 6.62,46.55 8.56,46.55 10.94,48.94 10.94,49.32 10.95,49.22 U$2.7
MOSI  (via drill 0.6)
  Top 0.229: v24.79,43.4 23.19,43.4 | 23.19,43.4 22.8,43.4 | U101.P122 48.33,43.55 | U101.P122 | v40.25,42.79 41.02,43.55 U101.P122 | 22.81,43.38 22.86,43.38 | 22.81,43.38 U301.1 | 22.81,43.38 22.78,43.38 22.68,43.38 23.06,43.76 23.19,43.76 23.19,43.4
  Top 0.406: 23.24,45.99 v23.24,46.22 23.24,43.83 22.78,43.38
  Bottom 0.229: v40.25,42.79 39.8,42.33 27.3,42.33 26.23,43.4 v24.79,43.4 15.21,43.4 14.22,44.39 9.88,44.39 8.66,43.17 J301.1
  Bottom 0.406: U$2.2 23.24,49.22 v23.24,46.22
N$1  (via drill 0.6)
  Top 0.229: v72.87,26.81 74.72,28.67 74.72,29.96 76.14,31.39 91.92,31.39 U601.1 | v31.87,28.29 31.64,28.06 31.64,26.26 29.43,24.05 29.43,10.84 30.65,9.62 v30.65,8.78
  Bottom 0.229: v72.87,26.81 71.85,25.8 50.31,25.8 49.93,26.18 49.93,27.4 48.53,28.8 44.9,28.8 43.35,27.25 34.11,27.25 33.07,28.29 v31.87,28.29 31.85,28.29 | 30.63,4.47 30.63,4.23 | J1.24 30.63,4.47 | v30.65,8.78 30.63,8.76 30.63,4.47
N$2  (via drill 0.6)
  Top 0.229: v72.92,25.34 75.2,27.63 75.2,29.79 76.35,30.93 89.84,30.93 U601.2 | v32.76,27.27 32.36,26.87 32.36,25.95 30.04,23.64 30.04,11.27 31.59,9.72 31.59,8.45 30.6,7.46 J1.55 | J1.55 30.6,4.21 | J1.55
  Bottom 0.229: v72.92,25.34 49.68,25.34 49.45,25.57 49.45,27.22 48.36,28.31 45.13,28.31 43.61,26.79 33.22,26.79 32.74,27.27 v32.76,27.27
N$3  (via drill 0.6)
  Top 0.229: v73.99,24.45 75.69,26.15 75.69,29.61 76.55,30.47 80.16,30.47 82.39,28.24 U601.6 | v30.78,26.81 28.67,24.71 28.67,9.67 28.93,9.42 28.93,8.4 28.06,7.54 28.06,4.46 | 28.06,4.46 28.06,4.44 | J1.56 28.06,4.46
  Bottom 0.229: v30.78,26.81 31.29,26.31 43.84,26.31 45.39,27.86 48.1,27.86 48.97,26.99 48.97,25.37 49.47,24.86 72.11,24.86 72.51,24.45 v73.99,24.45
N$4  (via drill 0.6)
  Top 0.229: v73.38,23.08 73.71,23.08 76.14,25.52 76.14,29.41 76.75,30.02 78.05,30.02 U601.7 | v29.15,26.64 28.09,25.57 v28.09,8.78
  Bottom 0.229: v73.38,23.08 73.38,23.18 72.54,24.02 72.26,24.02 71.88,24.4 49.25,24.4 48.48,25.16 48.48,26.81 47.9,27.4 45.72,27.4 44.12,25.8 29.99,25.8 v29.15,26.64 | 28.06,4.46 28.06,4.18 | J1.25 28.06,4.46 | v28.09,8.78 28.06,8.76 28.06,4.46
N$5
  Top 0.406: 17.04,40.63 17.01,40.66 | 17.04,40.63 Q301.2 | U301.7 19.12,38.55 17.04,40.63
N$6
  Top 0.406: Q301.1 17.14,35.58 19.31,37.75 U301.8
N$8
  Top 0.229: J301.5 9.57,39.41 12.24,39.41 13.31,40.48 13.31,43.43 13.89,44.01 18.99,44.01 20.47,42.54 20.47,41.42 20.95,40.94 22.12,40.94 | 22.79,40.94 22.86,40.94 | 22.79,40.94 U301.4 | 22.12,40.94 22.07,40.94 | 22.12,40.94 22.79,40.94
N$9
  Bottom 0.229: 34.92,71.93 R513.1 PWRLED.A
N$107
  Top 0.406: 6.51,56.63 6.68,56.63 | 6.51,56.63 R511.1 6.46,56.66 | R512.2 4.48,56.63 6.51,56.63 | 6.46,56.66 6.4,56.66 | U511.1 8.71,56.66 6.46,56.66
N$108
  Top 0.406: 10.98,21.89 10.99,21.89 | 10.98,21.89 R502.2 13.5,21.91 R501.1 13.48,21.93 13.48,21.94 14.04,21.94 U501.1 | 10.98,21.89 8.44,21.89 R503.2 8.41,21.89 6.65,21.89 6.14,22.4 6.14,26.36 6.93,27.15 8.12,27.15 C503.+
  Top 1.143: R501.1 13.53,21.88
PROG_B  (via drill 0.6)
  Top 0.229: U101.P143 v46.38,33.06
  Bottom 0.229: R302.1 43.99,32.1 44.95,33.06 v46.38,33.06
PROG_B_AVR  (via drill 0.6)
  Top 0.229: U301.12 24.58,32.56 v24.13,32.1
  Bottom 0.229: 39.06,32.1 R302.2 v24.13,32.1
RESET_DIR  (via drill 0.6)
  Top 0.229: U402.1 45.68,17.45 44.7,18.43 44.7,21.96 45.08,22.34 45.08,23.79 45.08,24.02 v45.79,24.73 | U301.14 26.21,33.52 26.18,33.5 v26.18,28.08
  Bottom 0.229: v45.79,24.73 29.08,24.73 26.18,27.63 v26.18,28.08
SCK  (via drill 0.6)
  Top 0.229: v24.76,41.29 24.31,41.75 U301.3 21.41,41.75 21.18,41.98 21.18,42.77 18.54,45.41 v15.31,45.41 | U101.P124 | v42.92,41.65 43.84,42.56 U101.P124 | J301.7 7.06,36.75 v7.06,45.41
  Bottom 0.229: v24.76,41.29 42.57,41.29 v42.92,41.65 | v7.06,45.41 15.18,45.41 | 15.18,45.41 15.11,45.41 | 15.18,45.41 v15.31,45.41 15.31,48.43 15.72,48.84 U$2.5
SD_DET  (via drill 0.6)
  Top 0.229: v5.18,34.23 8.66,34.23 9.52,35.1 9.52,36.37 9.98,36.82 11.6,36.82 12.06,36.37 12.06,35.22 15.03,32.25 19.91,32.25 21.53,33.88 21.53,34.82 22.07,35.35 U301.11 | U301.11 22.88,35.35 | U301.11
  Bottom 0.229: U$2.CARD_DET1 6.87,47.66 5.15,45.94 | v5.18,34.23 5.15,45.94 | 5.15,45.94 5.15,45.92
SD_SS  (via drill 0.6)
  Top 0.406: U301.44 24.58,46.8 v25.5,47.72
  Bottom 0.406: U$2.1 25.72,49.23 25.73,49.22 25.73,47.95 v25.5,47.72
SD_WP  (via drill 0.6)
  Top 0.406: 25.37,45.14 25.37,45.1 | U301.43 25.37,45.14 | 25.37,45.14 25.37,46.02 v26.18,46.83
  Bottom 0.406: 6.08,73.02 6.07,73.02 | U$2.WP_1 6.08,73.02 | 6.08,73.02 16.05,73.02 17.12,71.95 17.12,58.29 17.75,57.65 25.88,57.65 27,56.53 27,47.67 26.16,46.83 v26.18,46.83
SNES_/IRQ
  Top 0.229: U403.37 37.21,34.64 44.62,42.05 U101.P125
SNES_/IRQ_EXT  (via drill 0.6)
  Top 0.229: v35.38,11.3 35.35,11.3 37.21,13.15 U403.12
  Bottom 0.229: J1.18 45.56,4.54 45.56,9.72 43.99,11.3 v35.38,11.3 35.35,11.3
SNES_/RD
  Top 0.229: U101.P2 50.67,30.59 50.67,29.56 48.18,27.07 U402.43 | U402.43 48.18,22.55 | U402.43
SNES_/RD_EXT  (via drill 0.6)
  Top 0.229: U402.6 48.18,14.55 48.53,14.19 48.53,12.92 47.72,12.11 46.66,12.11 45.79,12.97 v44.95,12.97
  Bottom 0.229: 33.04,4.49 33.09,4.49 J1.23 33.09,4.51 33.07,4.51 33.07,7.94 32.05,8.96 32.05,9.95 34.9,12.79 39.49,12.79 40.15,13.45 44.47,13.45 v44.95,12.97
SNES_/RESET  (via drill 0.6)
  Top 0.229: U402.44 47.68,25.87 v47.09,26.46 | 27,33.56 27,33.77 | 27,33.56 U301.15 | 27.63,28.08 27.66,28.06 | v27.61,28.08 27.63,28.08 | 27,33.56 27,28.72 27.63,28.08
  Bottom 0.229: v47.09,26.46 45.69,26.46 44.55,25.32 29.23,25.32 27.63,26.92 27.63,28.06 v27.61,28.08
SNES_/RESET_EXT  (via drill 0.6)
  Top 0.229: U402.5 47.67,14.37 48.05,13.99 48.05,13.2 47.49,12.64 46.83,12.64 45.69,13.78 45.23,13.78 44.7,14.32 43.99,14.32 | 43.99,14.32 43.96,14.32 | v44.01,14.34 43.99,14.32
  Bottom 0.229: J1.26 25.65,4.54 25.6,4.59 25.6,8.48 29.66,12.54 33.9,12.54 34.72,13.35 39.37,13.35 40.36,14.34 v44.01,14.34
SNES_/ROMSEL
  Top 0.229: U101.P5 52.14,28.57 49.68,26.1 U402.40 | U402.40 49.68,22.78 | U402.40
SNES_/ROMSEL_EXT
  Top 0.229: U402.9 49.68,12.09 46.83,9.24 46.2,9.24 45.61,8.65 45.61,4.59 45.59,4.56 45.6,4.55 J1.49
SNES_/WR
  Top 0.229: U402.41 49.2,22.81 49.2,26.36 51.63,28.8 51.63,30.6 U101.P4
SNES_/WR_EXT  (via drill 0.6)
  Top 0.229: J1.54 33.08,4.5 33.07,4.49 v33.04,9.29 | v43.63,12.51 44.01,12.51 45.28,11.24 47.65,11.24 49.17,12.77 49.17,15.28 U402.8
  Bottom 0.229: v43.63,12.51 40.28,12.51 40.05,12.29 35.12,12.29 33.09,10.25 33.09,9.24 v33.04,9.29
SNES_A0
  Top 0.229: U101.P7 53.13,30.6 53.13,27.88 51.18,25.93 U402.37 | U402.37 51.18,22.67 | U402.37
SNES_A0_EXT  (via drill 0.6)
  Top 0.229: U402.12 51.18,11.5 v48.92,9.24
  Bottom 0.229: J1.17 48.14,4.54 48.15,4.54 48.15,8.48 v48.92,9.24
SNES_A1
  Top 0.229: U402.35 52.17,22.81 52.17,25.29 54.63,27.75 54.63,30.63 | 54.63,30.63 54.63,30.75 | 54.63,30.63 U101.P10
SNES_A1_EXT  (via drill 0.6)
  Top 0.229: U402.14 52.18,10.67 51.13,9.62 v51.13,9.24
  Bottom 0.229: v51.13,9.24 51.13,8.78 50.59,8.25 50.59,4.64 50.62,4.62 50.6,4.6 J1.16
SNES_A2
  Top 0.229: U402.32 53.69,22.8 53.69,25.11 55.65,27.07 U101.P12 | U101.P12 55.65,30.78 | U101.P12
SNES_A2_EXT  (via drill 0.6)
  Top 0.229: U402.17 53.68,9.79 v53.13,9.24
  Bottom 0.229: J1.15 53.1,4.56 53.13,4.59 v53.13,9.24
SNES_A3
  Top 0.229: U402.29 55.16,22.81 55.16,24.88 56.64,26.36 56.64,30.6 U101.P14
SNES_A3_EXT  (via drill 0.6)
  Top 0.229: U402.20 55.18,13.34 55.6,12.92 v55.6,9.24
  Bottom 0.229: J1.14 55.57,4.54 55.6,4.56 v55.6,9.24
SNES_A4
  Top 0.229: U402.26 56.66,22.81 56.66,24.66 58.14,26.13 58.14,30.62 | 58.14,30.62 | 58.14,30.62 U101.P17
SNES_A4_EXT  (via drill 0.6)
  Top 0.229: v58.09,9.24 58.09,12.44 56.66,13.86 56.66,15.28 U402.23
  Bottom 0.229: J1.13 58.1,9.22 v58.09,9.24
SNES_A5
  Top 0.229: U401.46 60.65,24.94 59.63,25.95 59.63,30.52 59.65,30.54 U101.P20
SNES_A5_EXT  (via drill 0.6)
  Top 0.229: v60.6,9.24 60.6,11.88 60.27,12.21 60.27,13.18 60.65,13.56 U401.3 | U401.3 60.65,15.31 | U401.3
  Bottom 0.229: J1.12 v60.6,9.24
SNES_A6
  Top 0.229: 61.16,30.6 U101.P23 61.15,30.54 61.16,30.52 61.13,30.5 61.13,25.95 62.15,24.93 U401.43
SNES_A6_EXT  (via drill 0.6)
  Top 0.229: v63.09,9.24 63.09,12.57 62.66,13 62.66,13.99 62.15,14.5 62.15,15.26 U401.6 62.15,15.23
  Bottom 0.229: J1.11 63.1,9.23 v63.09,9.24
SNES_A7
  Top 0.229: U401.40 63.65,24.86 62.15,26.36 62.15,30.5 U101.P25
SNES_A7_EXT  (via drill 0.6)
  Top 0.229: v65.6,9.24 65.6,11.8 63.65,13.76 63.65,15.26 U401.9
  Bottom 0.229: J1.10 v65.6,9.23 v65.6,9.24
SNES_A8
  Top 0.229: U401.37 65.15,24.88 63.14,26.89 63.14,30.55 63.15,30.56 U101.P27
SNES_A8_EXT  (via drill 0.6)
  Top 0.229: v68.09,9.24 68.09,10.91 65.15,13.86 65.15,15.21 U401.12
  Bottom 0.229: J1.9 68.1,9.23 v68.09,9.24
SNES_A9
  Top 0.229: U101.P30 64.65,28.1 66.16,26.59 66.16,22.88 66.19,22.85 66.15,22.82 U401.35
SNES_A9_EXT  (via drill 0.6)
  Top 0.229: U401.14 66.15,14.36 70.61,9.9 v70.61,9.24
  Bottom 0.229: J1.8 v70.61,9.24
SNES_A10
  Top 0.229: U101.P32 65.65,28.58 67.64,26.59 67.64,22.8 U401.32
SNES_A10_EXT  (via drill 0.6)
  Top 0.229: U401.17 67.65,14.35 70.68,11.32 72.23,11.32 73.1,10.46 v73.1,9.21
  Bottom 0.229: J1.7 73.1,4.61 73.1,4.62 v73.1,9.21
SNES_A11
  Top 0.229: U101.P35 67.15,28.6 69.16,26.59 69.16,22.85 69.15,22.84 U401.29
SNES_A11_EXT  (via drill 0.6)
  Top 0.229: U401.20 69.15,14.3 70.73,12.72 73.6,12.72 75.59,10.71 v75.59,9.24
  Bottom 0.229: J1.6 75.62,5.29 75.54,4.51 75.59,4.56 v75.59,9.24
SNES_A12
  Top 0.229: U101.P33 66.15,28.81 68.65,26.31 68.65,22.75 U401.30
SNES_A12_EXT
  Top 0.229: J1.37 75.6,7.85 74.7,8.76 74.7,10.51 73.22,11.98 70.79,11.98 68.63,14.14 68.63,15.28 68.64,15.29 U401.19
SNES_A13
  Top 0.229: U101.P31 65.15,28.36 67.15,26.36 67.15,22.83 67.15,22.82 U401.33
SNES_A13_EXT
  Top 0.229: J1.38 73.1,7.86 72.16,8.81 72.16,9.11 67.15,14.11 67.15,15.31 U401.16
SNES_A14
  Top 0.229: U101.P28 63.65,28.44 65.68,26.41 65.68,22.7 65.65,22.73 U401.36
SNES_A14_EXT
  Top 0.229: U401.13 65.65,14.07 69.72,10 69.72,8.65 70.58,7.79 70.58,4.62 70.61,4.59 70.6,4.58 J1.39
SNES_A15
  Top 0.229: U401.38 64.65,24.59 62.66,26.59 62.66,30.52 62.65,30.53 U101.P26
SNES_A15_EXT
  Top 0.229: U401.11 64.65,13.52 67.03,11.14 67.03,8.88 68.07,7.84 68.07,4.56 68.1,4.53 J1.40
SNES_A16
  Top 0.229: U401.41 63.15,24.62 61.64,26.13 61.64,30.6 U101.P24
SNES_A16_EXT
  Top 0.229: U401.8 63.15,13.24 64.54,11.85 64.54,8.86 65.6,7.79 65.6,4.49 65.6,4.48 | 65.6,4.48 65.58,4.46 | J1.41 65.6,4.48
SNES_A17
  Top 0.229: 61.62,22.62 61.65,22.66 U401.44 61.65,24.75 60.17,26.23 60.17,30.47 60.15,30.49 U101.P21
SNES_A17_EXT
  Top 0.229: U401.5 61.65,14.21 62.07,13.78 62.07,8.86 63.06,7.87 63.06,4.54 J1.42
SNES_A18
  Top 0.229: U401.47 60.15,24.65 58.64,26.15 U101.P18
SNES_A18_EXT
  Top 0.229: U401.2 60.15,13.84 59.71,13.4 59.71,8.78 60.6,7.89 60.6,4.56 J1.43
SNES_A19
  Top 0.229: U402.27 | U402.27 56.18,24.99 57.15,25.95 U101.P15 | U101.P15 57.15,30.78 | U101.P15
SNES_A19_EXT
  Top 0.229: U402.22 56.18,13.53 57.09,12.62 57.09,8.88 58.11,7.87 58.11,5.22 58.14,5.2 58.14,4.54 J1.44
SNES_A20
  Top 0.229: U402.30 54.66,22.82 54.66,25.21 56.13,26.69 56.13,30.63 | 56.13,30.63 56.13,30.83 | 56.13,30.63 U101.P13
SNES_A20_EXT
  Top 0.229: U402.19 54.68,8.88 55.6,7.97 55.6,4.46 | 55.6,4.46 55.62,4.44 | J1.45 55.6,4.46
SNES_A21
  Top 0.229: U402.33 53.18,25.47 55.14,27.42 55.14,30.62 | 55.14,30.62 55.14,30.83 | 55.14,30.62 U101.P11
SNES_A21_EXT
  Top 0.229: U402.16 53.18,10.81 52.22,9.85 52.22,8.86 53.11,7.97 53.11,4.59 53.16,4.54 53.12,4.5 J1.46
SNES_A22
  Top 0.229: U402.36 51.68,25.65 53.64,27.6 U101.P8 | U101.P8 53.64,30.7 | U101.P8
SNES_A22_EXT
  Top 0.229: U402.13 51.68,11.24 50.14,9.7 50.14,8.73 50.59,8.27 50.59,4.95 50.62,4.92 50.6,4.9 J1.47
SNES_A23
  Top 0.229: U101.P6 52.62,30.59 52.62,28.31 50.69,26.38 50.69,22.78 | 50.69,22.78 50.69,22.7 | U402.38 50.69,22.78
SNES_A23_EXT
  Top 0.229: U402.11 50.68,11.84 49.22,10.38 48.69,10.38 47.93,9.62 47.93,8.55 48.05,8.43 48.05,4.62 48.1,4.56 J1.48
SNES_CPU_CLK
  Top 0.229: U402.46 | 50.14,30.04 50.14,30.6 U101.P1 50.16,30.6 50.16,29.84 49.63,29.3 48,29.3 45.92,27.22 45.92,25.98 46.68,25.21 U402.46
SNES_CPU_CLK_EXT  (via drill 0.6)
  Top 0.229: U402.3 | J1.57 25.62,4.52 25.62,10.03 v25.6,10.05 | U402.3 46.68,14.47 46.48,14.27 45.44,14.27 44.6,15.11 v44.57,15.56
  Bottom 0.229: 28.44,12.21 26.28,10.05 v25.6,10.05 | 28.44,12.21 28.49,12.26 | 28.44,12.21 29.33,13.1 33.75,13.1 34.54,13.89 39.14,13.89 40.84,15.59 44.57,15.59 v44.57,15.56
SNES_D0
  Top 0.229: U403.26 42.71,34.15 44.62,36.06 48.15,36.06 48.16,36.06 U101.P137
SNES_D0_EXT  (via drill 0.6)
  Top 0.229: U403.23 42.71,9.68 v43.1,9.29
  Bottom 0.229: J1.19 43.09,4.51 43.07,4.51 43.07,8.73 v43.1,9.29
SNES_D1
  Top 0.229: U403.29 41.21,34.17 45.61,38.58 48.1,38.58 48.12,38.56 U101.P132
SNES_D1_EXT  (via drill 0.6)
  Top 0.229: U403.20 41.21,9.84 v40.64,9.26
  Bottom 0.229: J1.20 40.6,4.55 40.64,4.59 v40.64,9.26
SNES_D2
  Top 0.229: U403.32 39.71,34.12 45.16,39.57 U101.P130
SNES_D2_EXT  (via drill 0.6)
  Top 0.229: U403.17 39.71,10.85 v38.15,9.29
  Bottom 0.229: J1.21 38.1,4.54 38.15,4.59 v38.15,9.29
SNES_D3
  Top 0.229: U403.35 38.21,34.09 44.67,40.56 48.13,40.56 U101.P128
SNES_D3_EXT  (via drill 0.6)
  Top 0.229: U403.14 38.21,11.87 v35.61,9.26
  Bottom 0.229: J1.22 35.57,4.5 35.56,4.51 35.61,4.56 v35.61,9.26
SNES_D4
  Top 0.229: U403.27 42.21,34.41 44.88,37.08 48.18,37.08 U101.P135 | U101.P135 48.2,37.05 | U101.P135
SNES_D4_EXT
  Top 0.229: U403.22 | U403.22 42.21,8.88 43.07,8.02 43.07,4.54 J1.50
SNES_D5
  Top 0.229: U403.30 40.71,34.38 45.39,39.06 48.15,39.06 48.18,39.08 U101.P131
SNES_D5_EXT
  Top 0.229: U403.19 40.71,10.91 39.67,9.87 39.67,8.86 40.58,7.94 40.58,4.56 40.6,4.55 J1.51
SNES_D6
  Top 0.229: U403.33 39.21,34.36 44.93,40.07 48.18,40.07 U101.P129
SNES_D6_EXT
  Top 0.229: U403.16 39.21,11.42 38.1,10.3 37.71,10.3 37.16,9.75 37.16,8.93 38.12,7.97 38.12,4.54 38.1,4.52 J1.52
SNES_D7
  Top 0.229: U403.36 37.71,34.35 44.42,41.06 48.15,41.06 48.16,41.06 U101.P127
SNES_D7_EXT
  Top 0.229: U403.13 37.71,12.38 35.61,10.28 35.23,10.28 34.64,9.7 34.64,8.91 35.58,7.97 35.58,4.52 J1.53
SNES_DATABUS_/OE
  Top 0.229: U403.25 43.21,33.25 44.52,34.56 U101.P140 | U101.P140 48.36,34.56 | U101.P140
SNES_DATABUS_DIR
  Top 0.229: 44.14,24.4 44.14,18.41 43.21,17.48 U403.24 | 44.14,24.4 44.14,24.58 | U101.P141 48.19,34.06 48.18,34.05 49.58,34.05 49.93,33.7 49.93,32.38 44.14,26.59 44.14,24.4
SNES_REFRESH
  Top 0.229: U401.27 70.15,26.33 67.64,28.85 67.64,30.62 U101.P36
SNES_REFRESH_EXT  (via drill 0.6)
  Top 0.229: J1.33 v90.6,8.8 v90.6,8.81 | 70.15,15.26 U401.22 | v88.67,18.48 88.62,18.48 88.41,18.28 76.17,18.28 71.85,13.96 70.43,13.96 70.15,14.24 U401.22 | U401.22
  Bottom 0.229: v90.6,8.81 90.6,16.55 v88.67,18.48
SNES_SYS_CLK  (via drill 0.6)
  Top 0.229: U101.P55 69.56,41.56 69.54,41.55 v67.53,41.55 | U401.26 70.63,22.79 70.63,26.59 68.14,29.08 68.14,32.2 67.53,32.81 v67.53,33.09
  Bottom 0.229: v67.53,33.09 v67.53,41.55
SNES_SYS_CLK_EXT  (via drill 0.6)
  Top 0.229: U401.23 70.67,15.29 70.68,15.28 70.66,15.26 70.66,14.55 70.81,14.39 71.57,14.39 75.99,18.81 87.83,18.81 88.39,19.37 88.95,19.37 89.81,18.51 v91.26,18.51
  Bottom 0.229: J1.1 93.1,16.67 v91.26,18.51
SRAM_/BHE  (via drill 0.3)
  Top 0.152: U101.P78 65.15,53.89 65.38,54.12 66.34,54.12 66.54,54.32 75.84,54.32 76.04,54.12 93.09,54.12 95.02,56.05 95.02,69.54 94.41,70.15 86.23,70.15 85.82,69.74 85.52,69.74 85.31,69.54 v85.21,69.54 84.81,69.54 84.3,70.05 77.14,70.05 76.55,70.63 73.45,70.63 73.05,70.22 72.77,70.22 v72.56,70.02 72.36,70.22 72.08,70.22 71.78,70.53 64.33,70.53 63.93,70.93 60.68,70.93 60.07,70.33 v59.91,70.33 59.76,70.33 59.25,70.83 51.79,70.83 51.38,71.24 48.1,71.24 v47.9,71.04
  Bottom 0.152: v85.21,69.54 85.21,70.43 85.72,70.93 85.72,72.03 85.19,72.56 85.19,75.63 U204.14 | U203.14 72.5,72.85 73.07,72.28 73.07,71.11 72.56,70.6 v72.56,70.02 | U202.14 59.8,72.88 60.42,72.26 60.42,71.11 59.91,70.6 v59.91,70.33 | U201.14 47.1,72.85 47.9,72.05 v47.9,71.04
SRAM_/BLE  (via drill 0.3)
  Top 0.152: U101.P79 64.65,54.18 64.89,54.42 66.21,54.42 66.42,54.63 75.97,54.63 76.17,54.42 92.96,54.42 94.71,56.18 94.71,69.41 94.28,69.84 86.51,69.84 v85.87,69.21 85.7,69.03 84.88,69.03 84.17,69.74 77.01,69.74 76.42,70.33 73.58,70.33 73.22,69.97 v73.22,69.72 73.02,69.51 72.33,69.51 71.62,70.22 64.21,70.22 63.8,70.63 60.93,70.63 60.6,70.3 v60.6,70.12 60.3,69.82 59.66,69.82 58.95,70.53 51.66,70.53 51.25,70.93 48.76,70.93 v48.56,70.73
  Bottom 0.152: v85.87,69.21 85.87,70.66 86.03,70.81 86.03,72.15 85.7,72.48 85.7,75.68 U204.15 | U203.15 73,72.78 73.38,72.41 73.38,69.87 v73.22,69.72 | U202.15 60.3,72.81 60.75,72.36 60.75,70.27 v60.6,70.12 | U201.15 47.6,72.78 48.56,71.82 v48.56,70.73
SRAM_/OE  (via drill 0.3)
  Top 0.152: U101.P93 57.65,54.08 57.27,54.45 55.62,54.45 52.83,57.24 50.92,57.24 50.64,57.52 v50.64,58.26 52.32,58.26 52.73,57.85 63.09,57.85 v63.29,58.06 63.42,58.18 65.02,58.18 65.22,57.98 75.92,57.98 75.99,58.06 v75.99,58.18 77.77,58.18 78.18,57.78 88.51,57.78 88.69,57.96 v88.69,57.98
  Bottom 0.152: U201.28 50.62,56.43 50.64,56.46 v50.64,58.26 | U202.28 63.3,58.07 v63.29,58.06 | v75.99,58.18 U203.28 | U204.28 88.7,58 v88.69,57.98
SRAM_/WE  (via drill 0.3)
  Top 0.152: U101.P70 72.51,49.07 76.04,52.6 93.75,52.6 96.54,55.39 96.54,60.14 | 96.54,60.14 96.54,60.17 | 96.54,60.14 96.54,70.17 95.04,71.67 84.76,71.67 v84.55,71.47 84.35,71.26 77.64,71.26 77.06,71.85 72.11,71.85 v71.9,71.65 71.7,71.44 64.71,71.44 64.31,71.85 59.46,71.85 v59.25,71.65 59.05,71.44 52.04,71.44 51.63,71.85 46.73,71.85 v46.53,71.65
  Bottom 0.152: U204.11 83.7,73.18 84.55,72.33 v84.55,71.47 | U203.11 71,73.49 71.9,72.59 v71.9,71.65 | U202.11 58.3,73.51 59.25,72.56 v59.25,71.65 | U201.11 45.6,73.49 46.53,72.56 v46.53,71.65
SRAM_A0  (via drill 0.3)
  Top 0.152: U101.P92 58.15,54.01 57.4,54.75 55.75,54.75 52.95,57.55 52.7,57.55 | 52.7,57.55 52.27,57.55 52.12,57.7 v52.09,57.75 | 52.7,57.55 64.41,57.55 64.54,57.68 v64.79,57.68 v77.54,57.68 77.74,57.47 90.09,57.47 v90.29,57.68
  Bottom 0.152: U201.25 52.09,56.41 | U201.25 | U201.25 v52.09,57.75 | v64.79,57.68 64.82,57.7 64.82,56.45 U202.25 | U203.25 arc90 77.54,56.47 v77.54,57.68 | U204.25 90.19,57.57 v90.29,57.68
SRAM_A1  (via drill 0.3)